# EasyEDA Pro project ACS Temperature Sensor.eprj

# Schematic Main Board

## Sheets
1 User Interface: Board Name: V3.0.0; Create Date: 2026-03-11; Page Name: User Interface; Project Name: ACS Temperature Sensor; Schematic Name: Main Board; Update Date: 2026-03-11; Company: EasyEDA.com; Page Size: A4; Version: V1.0
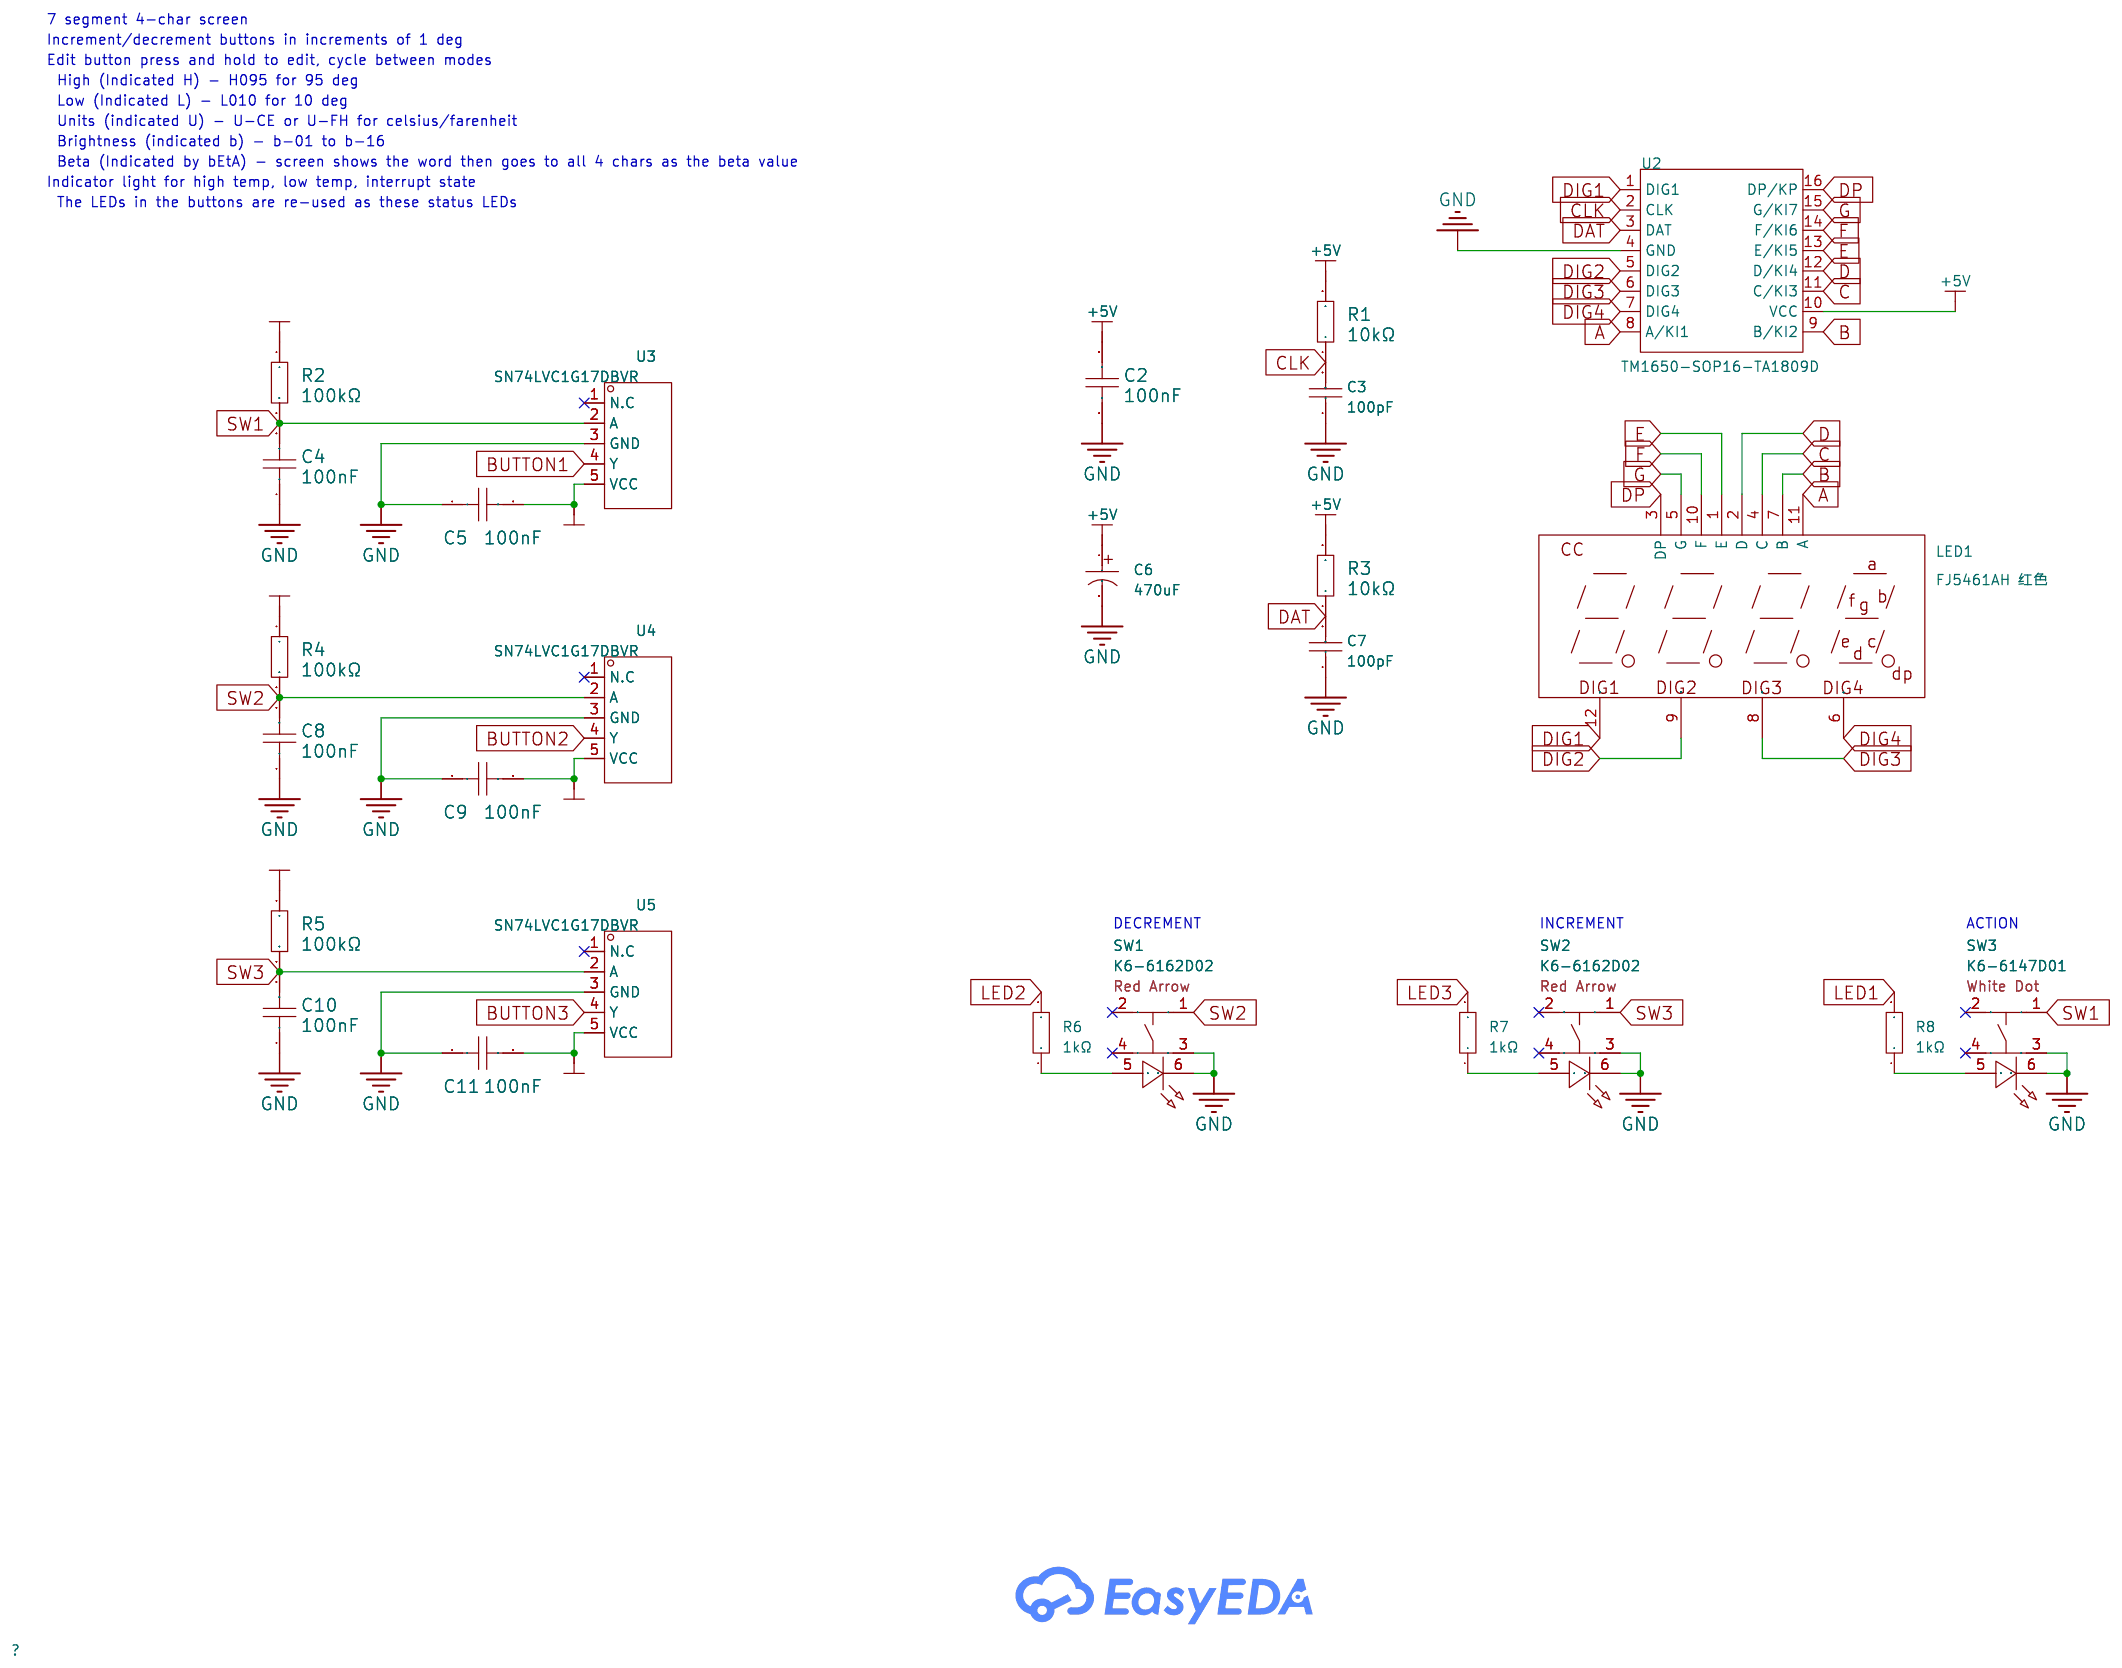
[diagram p0: User Interface]
2 ACS Interface: Page Name: ACS Interface; Update Date: 2026-03-12
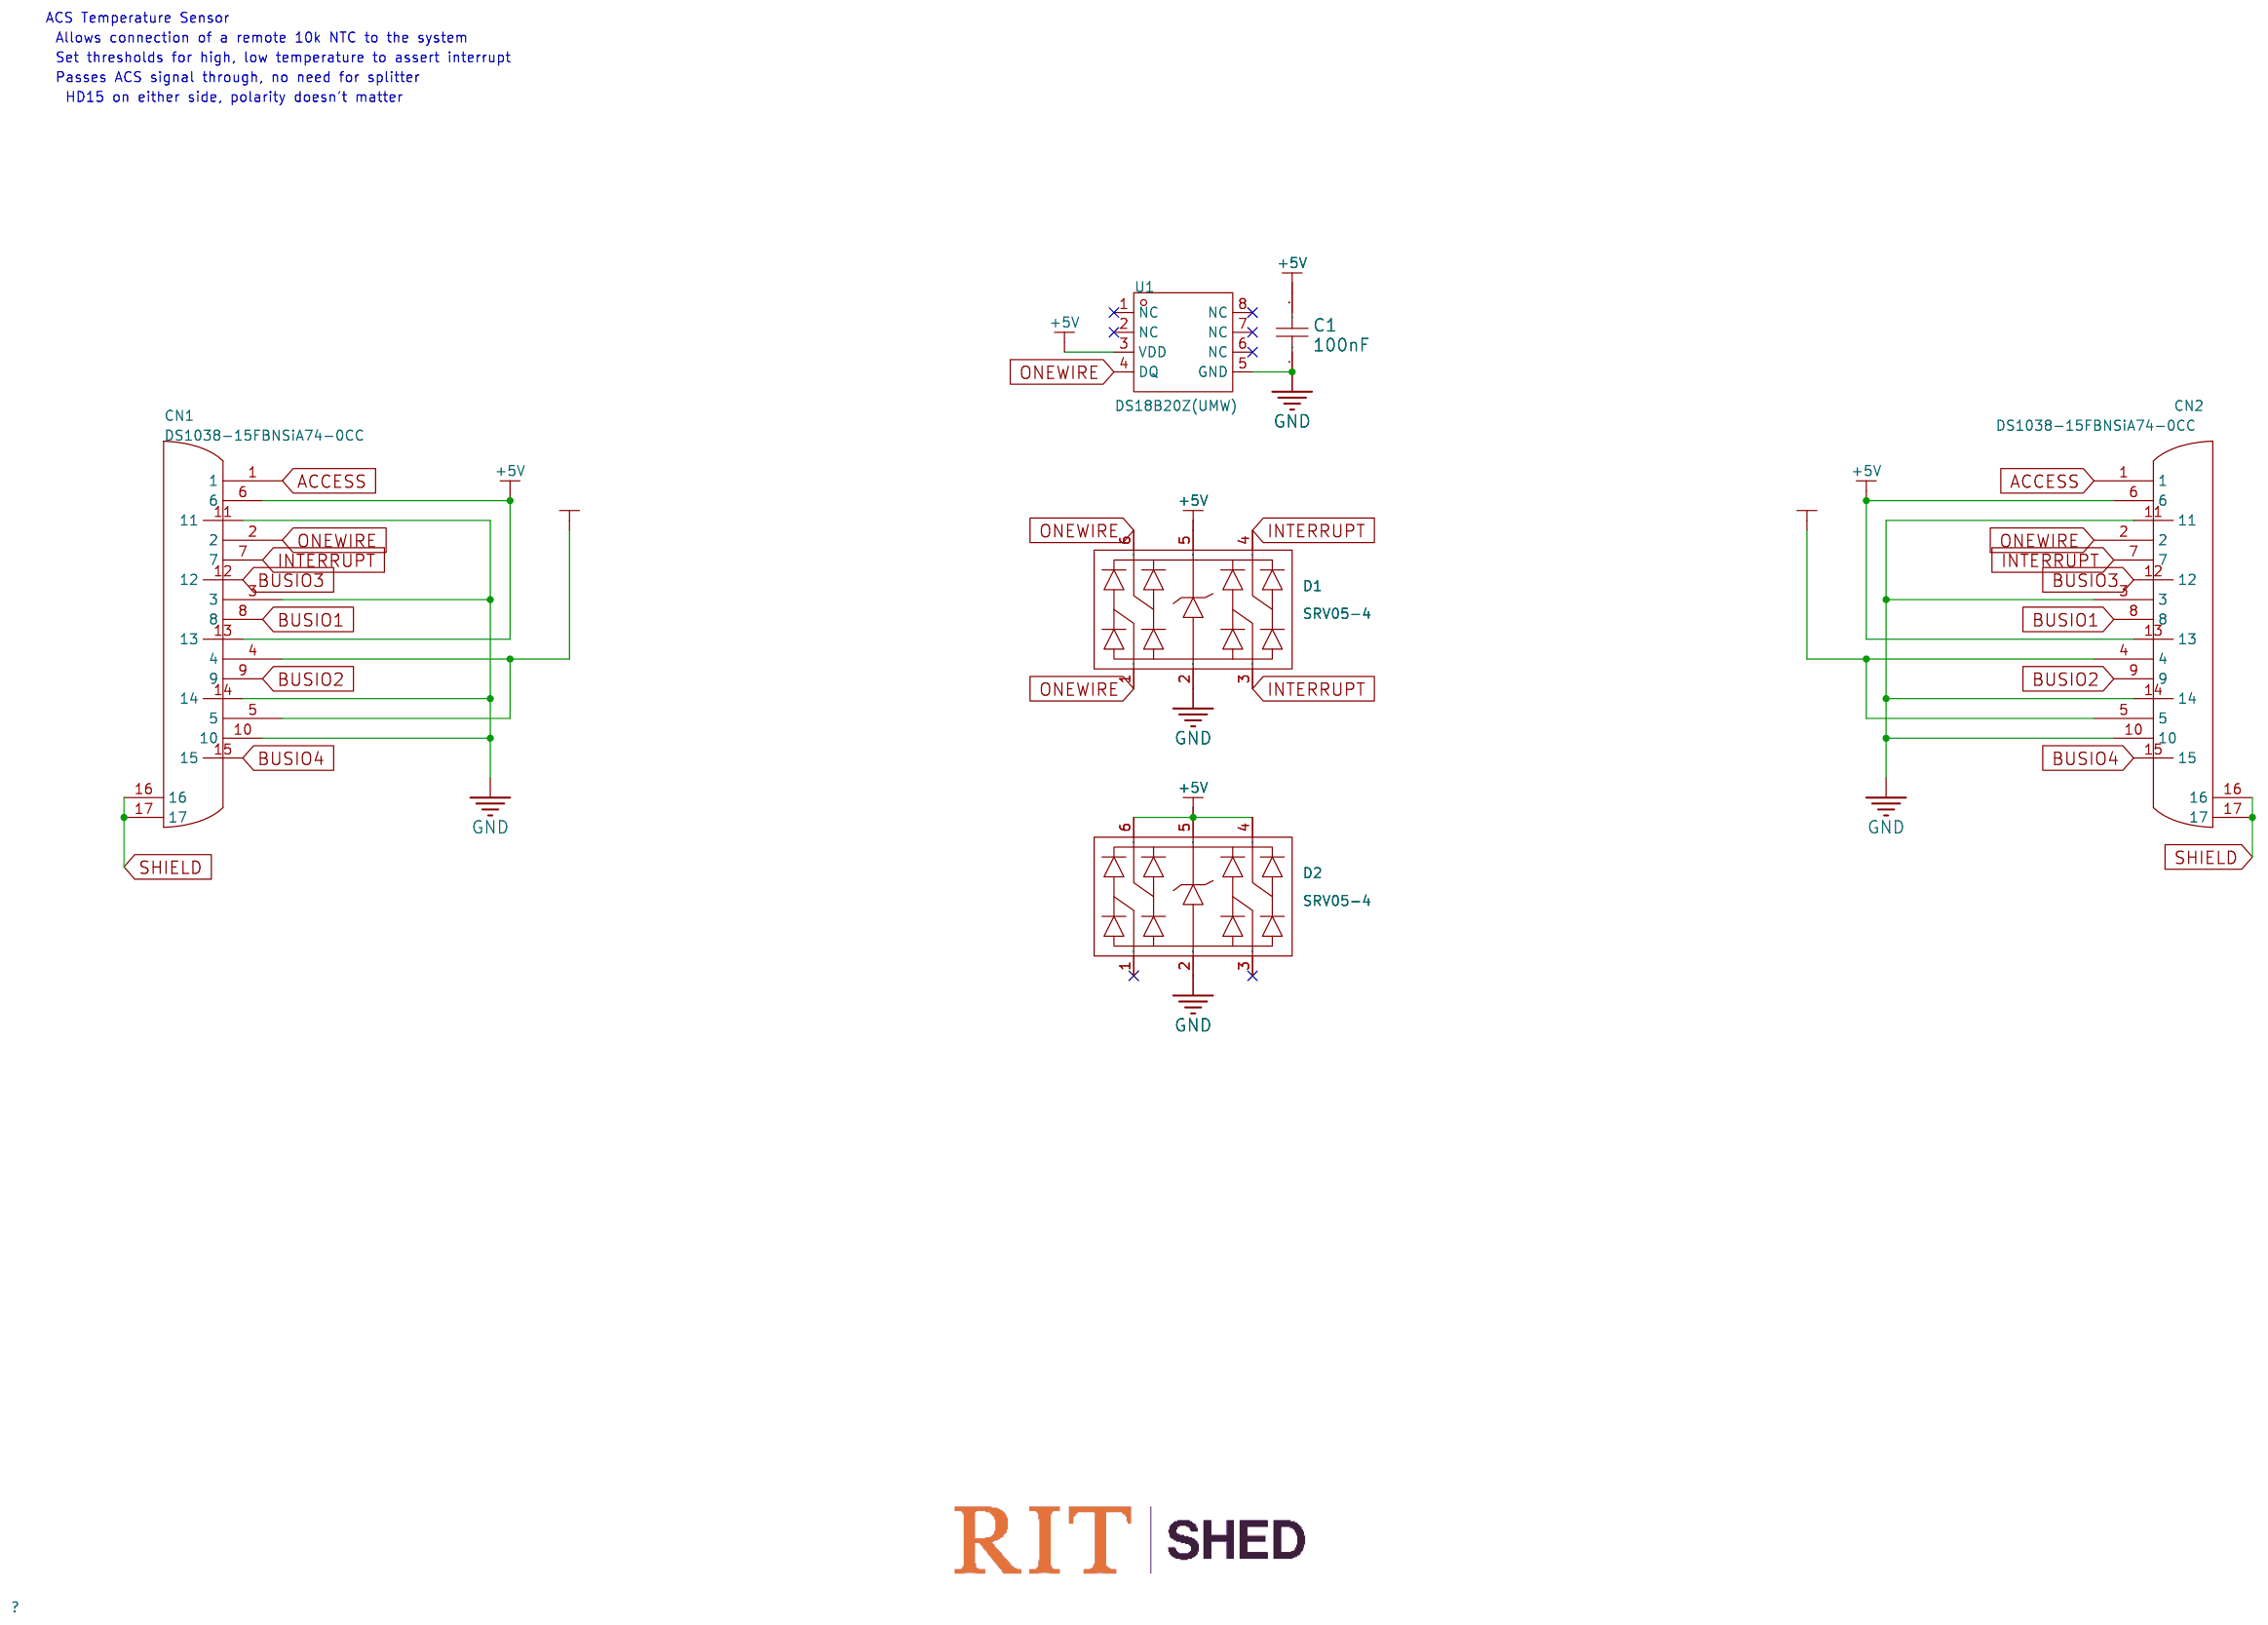
[diagram p1: ACS Interface]
3 Microcontroller: Page Name: Microcontroller
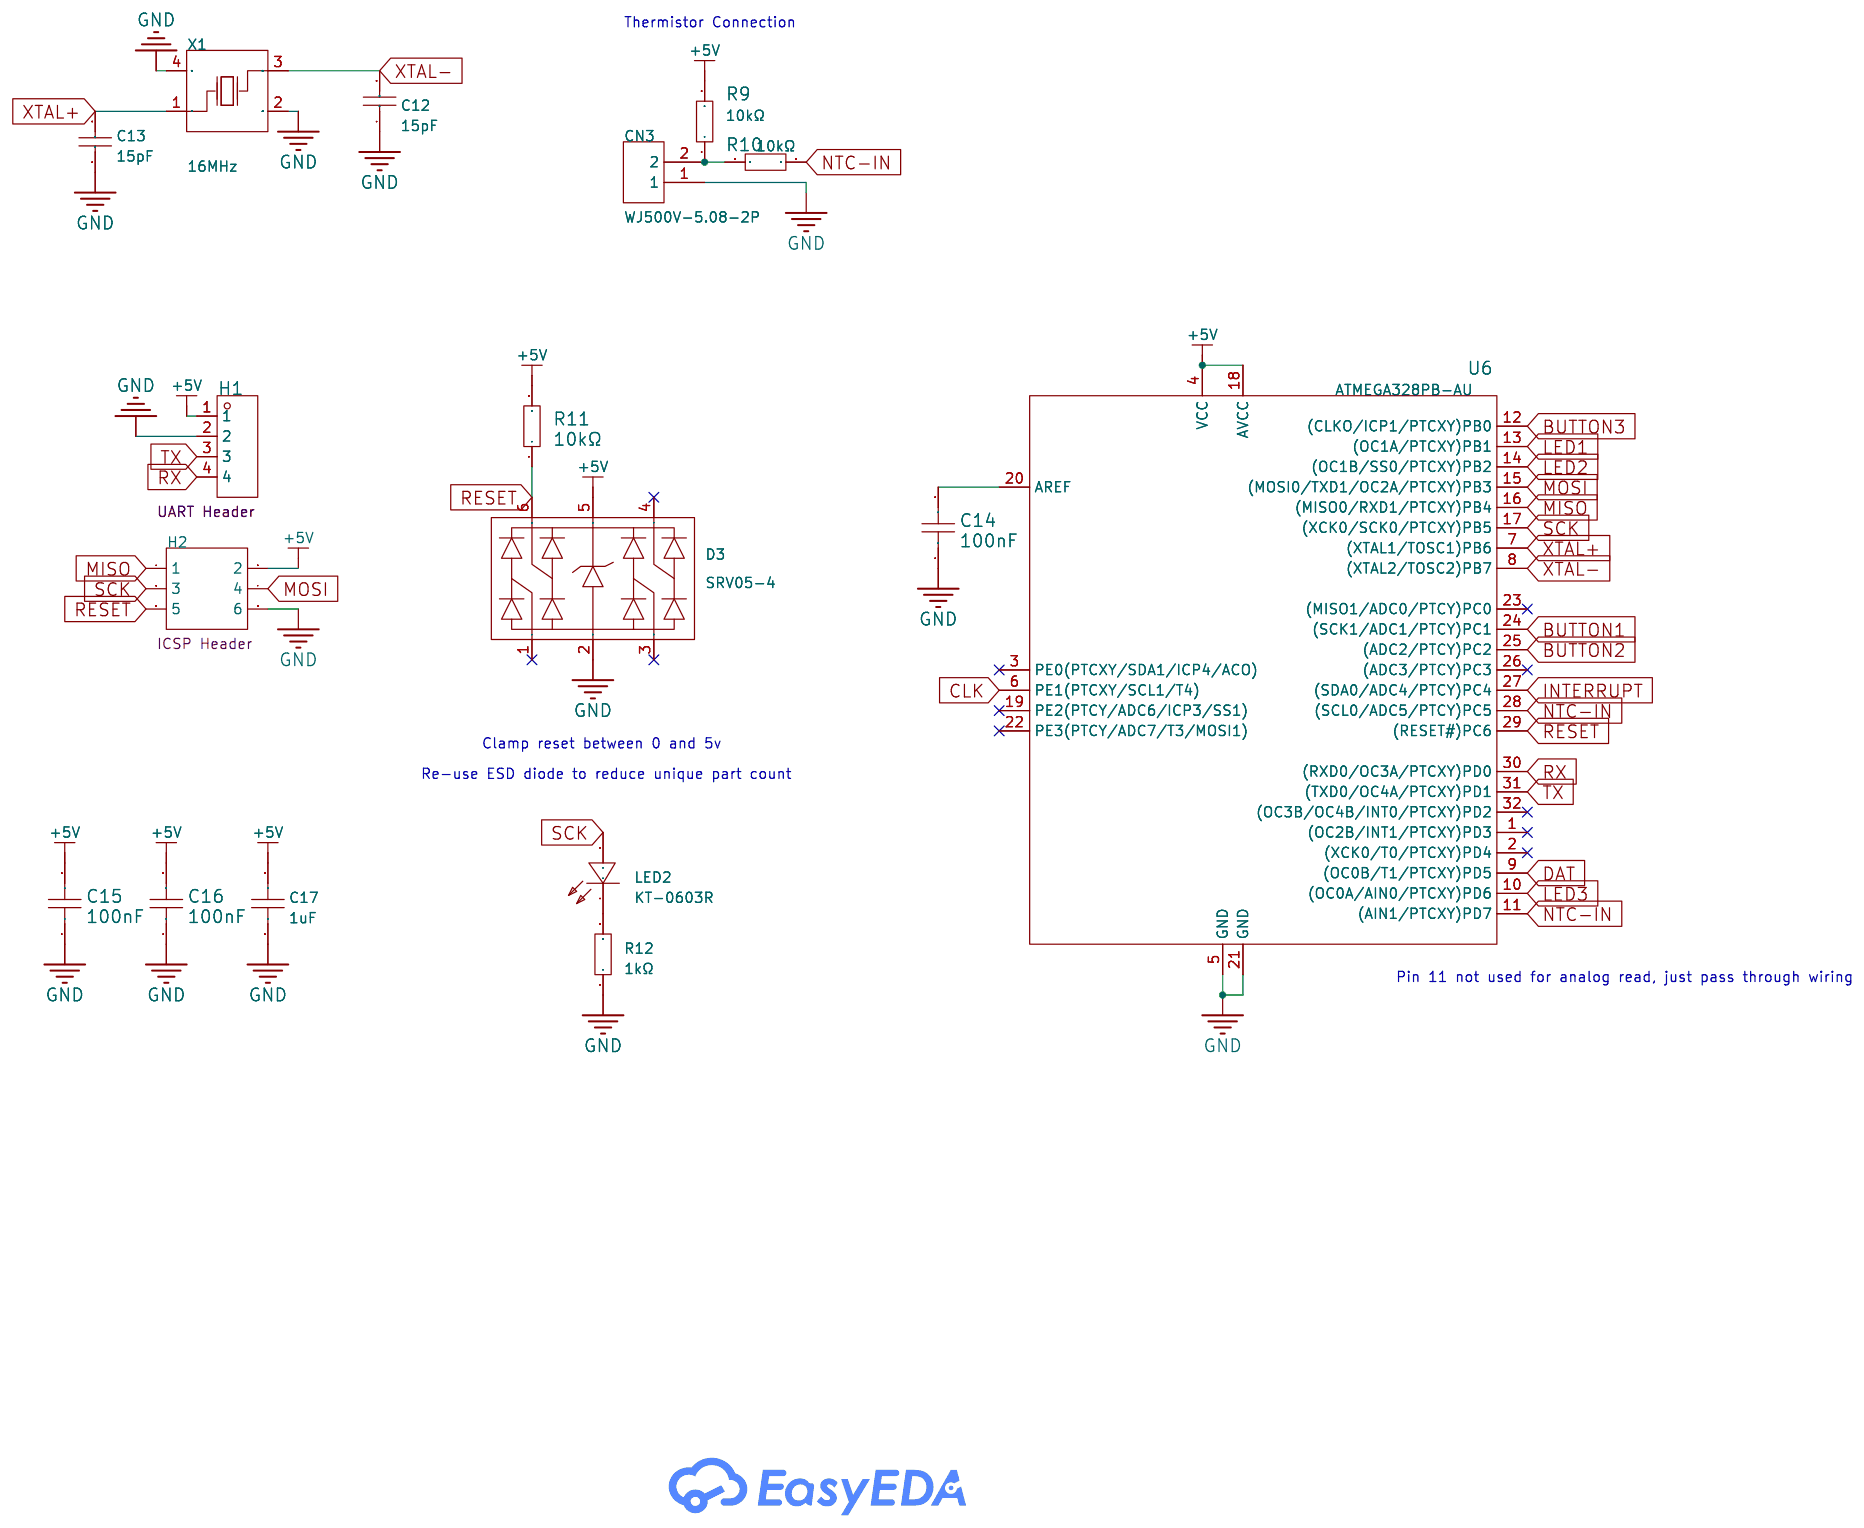
[diagram p2: Microcontroller]

## Parts
sheet ACS Interface
C1  100nF  [C0603]
CN1  DS1038-15FBNSiA74-0CC  [DSUB-TH_DS1038-15FBNSIA74-0CC]
CN2  DS1038-15FBNSiA74-0CC  [DSUB-TH_DS1038-15FBNSIA74-0CC]
D1  SRV05-4  [SOT-23-6_L2.9-W1.6-P0.95-LS2.8-BL]
D2  SRV05-4  [SOT-23-6_L2.9-W1.6-P0.95-LS2.8-BL]
U1  DS18B20Z(UMW)  [SOP-8_L4.9-W3.9-P1.27-LS6.0-BL]
sheet Microcontroller
C12  15pF  [C0603]
C13  15pF  [C0603]
C14  100nF  [C0603]
C15  100nF  [C0603]
C16  100nF  [C0603]
C17  1uF  [C0603]
CN3  WJ500V-5.08-2P  [CONN-TH_2P-P5.00_WJ500V-5.08-2P]
D3  SRV05-4  [SOT-23-6_L2.9-W1.6-P0.95-LS2.8-BL]
H1  -  [HDR-TH_4P-P2.54-V-F]
H2  -  [HDR-TH_6P-P2.54-V-F-R2-C3-S2.54]
LED2  KT-0603R  [LED0603-RD]
R9  10kΩ  [R0603]
R10  10kΩ  [R0603]
R11  10kΩ  [R0603]
R12  1kΩ  [R0603]
U6  ATMEGA328PB-AU  [TQFP-32_L7.0-W7.0-P0.80-LS9.0-BL]
X1  16MHz  [OSC-SMD_4P-L3.2-W2.5-BL]
sheet User Interface
C2  100nF  [C0603]
C3  100pF  [C0603]
C4  100nF  [C0603]
C5  100nF  [C0603]
C6  470uF  [CAP-TH_BD8.0-P3.50-D0.6-FD]
C7  100pF  [C0603]
C8  100nF  [C0603]
C9  100nF  [C0603]
C10  100nF  [C0603]
C11  100nF  [C0603]
LED1  FJ5461AH 红色  [LED-SEG-TH_FJ5461AH]
R1  10kΩ  [R0603]
R2  100kΩ  [R0603]
R3  10kΩ  [R0603]
R4  100kΩ  [R0603]
R5  100kΩ  [R0603]
R6  1kΩ  [R0603]
R7  1kΩ  [R0603]
R8  1kΩ  [R0603]
SW1  K6-6162D02  [SW-TH_K6-6162D04]
SW2  K6-6162D02  [SW-TH_K6-6162D04]
SW3  K6-6147D01  [SW-TH_K6-6162D04]
U2  TM1650-SOP16-TA1809D  [SOP-16_L9.9-W3.9-P1.27-LS6.0-BL]
U3  SN74LVC1G17DBVR  [SOT-23-5_L3.0-W1.7-P0.95-LS2.8-BR]
U4  SN74LVC1G17DBVR  [SOT-23-5_L3.0-W1.7-P0.95-LS2.8-BR]
U5  SN74LVC1G17DBVR  [SOT-23-5_L3.0-W1.7-P0.95-LS2.8-BR]

## Library data of the parts
C1 C14-C16 = CC0603KRX7R9BB104: LCSC Part Name: 100nF ±10% 50V; Supplier Part: C14663; Manufacturer: YAGEO(国巨); Supplier Footprint: 0603; Datasheet: https://item.szlcsc.com/datasheet/CC0603KRX7R9BB104/15331.html; Supplier: LCSC; Tolerance: ±10%; Voltage Rating: 50V; Temperature Coefficient: X7R
CN1 CN2 = DS1038-15FBNSiA74-0CC: Connector Type:High Density D-Sub Gender:Female Number of Pins:15P Mounting Type:Right Angle Number of Rows:3 Current Rating-Signal:3A Current Rating-Power:- Voltage Rating:- Color:Black Operating Temperature:-40℃~+105℃ Operating Temperature:-40℃~+105℃; LCSC Part Name: 黑色 1000/盒 D-Sub 母 P数:15P; Supplier Part: C75754; Manufacturer: CONNFLY; Supplier Footprint: 弯插; JLCPCB Part Class: Extended Part; Datasheet: https://item.szlcsc.com/datasheet/DS1038-15FBNSiA74-0CC/76880.html; Supplier: LCSC; Connector Type: High Density D-Sub; Gender: Female; Number of Pins: 15P; Mounting Type: Right Angle; Number of Rows: 3; Current Rating-Signal: 3A; Color: Black; Operating Temperature: -40℃~+105℃
D1-D3 = SRV05-4_C558418: polarity:Unidirectional Reverse Stand-Off Voltage (Vrwm):5V Maximum Clamping Voltage:20V Peak Pulse Current (Ipp):3A Peak Pulse Power Dissipation (Ppp):60W Breakdown Voltage:6V Reverse Leakage Current (Ir):500nA Number of Lines:Four channels Operating Tem; LCSC Part Name: ESD，可防25kV静电; Supplier Part: C558418; Manufacturer: TECH PUBLIC(台舟); Supplier Footprint: SOT-23-6; JLCPCB Part Class: Extended Part; Datasheet: https://atta.szlcsc.com/upload/public/pdf/source/20230615/CFFDFFE99FDA0E92DF9600783B3A2A20.pdf; Supplier: LCSC; polarity: Unidirectional; Reverse Stand-Off Voltage (Vrwm): 5V; Maximum Clamping Voltage: 20V; Peak Pulse Current (Ipp): 3A; Peak Pulse Power Dissipation (Ppp): 60W; Breakdown Voltage: 6V; Reverse Leakage Current (Ir): 500nA; Number of Lines: Four channels; Operating Temperature: -55℃~+125℃; level of protection: IEC 61000-4-2; Type: ESD
U1 = DS18B20Z(UMW): Temperature range:- Temperature range:- Resolution:±0.4℃ Resolution:±0.4℃ Supply Voltage:2.5V~5.5V Supply Voltage:2.5V~5.5V; LCSC Part Name: 温度传感器; Supplier Part: C695837; Manufacturer: UMW(友台半导体); Supplier Footprint: SOIC-8; JLCPCB Part Class: Extended Part; Datasheet: https://atta.szlcsc.com/upload/public/pdf/source/20241210/329D6A12FB6ADF2EBB286F6D44242ED4.pdf; Supplier: LCSC; Resolution: ±0.4℃; Supply Voltage: 2.5V~5.5V
C12 C13 = CL10C150JB8NNNC: Capacitance:15pF Tolerance:±5% Tolerance:±5% Voltage Rating:50V Temperature Coefficient:C0G; LCSC Part Name: 15pF ±5% 50V; Supplier Part: C1644; Manufacturer: SAMSUNG(三星); Supplier Footprint: 0603; JLCPCB Part Class: Basic Part; Datasheet: https://item.szlcsc.com/datasheet/CL10C150JB8NNNC/1996.html; Supplier: LCSC; Tolerance: ±5%; Voltage Rating: 50V; Temperature Coefficient: C0G
C17 = CL10A105KB8NNNC: Capacitance:1uF Tolerance:±10% Tolerance:±10% Voltage Rating:50V Temperature Coefficient:X5R; LCSC Part Name: 1uF ±10% 50V; Supplier Part: C15849; Manufacturer: SAMSUNG(三星); Supplier Footprint: 0603; JLCPCB Part Class: Basic Part; Datasheet: https://item.szlcsc.com/datasheet/CL10A105KB8NNNC/16531.html; Supplier: LCSC; Tolerance: ±10%; Voltage Rating: 50V; Temperature Coefficient: X5R
CN3 = WJ500V-5.08-2P: LCSC Part Name: 1x2P 5.08mm 直插 排数:1 每排P数:2; Supplier Part: C8465; Manufacturer: KANGNEX(康奈克斯电气); Supplier Footprint: 插件,P=5.08mm; Datasheet: https://atta.szlcsc.com/upload/public/pdf/source/20191225/C8465_02D34CE5B5B4A53DF5891601D97FA9F4.pdf; Supplier: LCSC; Structure: 1x2P; Pitch: 5.08mm; Color: Green; Mounting Style: Direct Insert; Current Rating (Max): 18A; Voltage Rating (Max): 250V; Number of Pins: 2P; Number of Rows: 1; Wire Gauge - AWG: 14~30; Wire Gauge - mm2: 2.5; Number of PINs Per Row: 2; Operating Temperature Range: -40℃~+105℃; Screw Specification: M2.5
H1 = HDR-F_2.54_1x4P: UART Header; Supplier Footprint: Through
H2 = HDR-F_2.54_2x3: ICSP Header; Supplier Footprint: Through
LED2 = KT-0603R: Emitted Color:Red Power Dissipation:- Forward Current:- Dominant Wavelength:- Dominant Wavelength:- Peak Wavelength:- Diode Configuration:- Lens Color:- Color Temperature:- Color Temperature:- Viewing Angle:- Mounting Sytle:- Operating Temperature:-40℃~+8; LCSC Part Name: 0603 红灯 高亮; Supplier Part: C2286; Manufacturer: KENTO; Supplier Footprint: 0603; Datasheet: https://atta.szlcsc.com/upload/public/pdf/source/20160616/1466072038404.pdf; Supplier: LCSC; Emitted Color: Red; Operating Temperature: -40℃~+85℃
R9 R10 = 0603WAF1002T5E: LCSC Part Name: 厚膜电阻 10kΩ ±1% 100mW; Supplier Part: C25804; Manufacturer: UNI-ROYAL(厚声); Supplier Footprint: 0603; Datasheet: https://item.szlcsc.com/datasheet/0603WAF1002T5E/26547.html; Supplier: LCSC; Type: Thick Film Resistor; Tolerance: ±1%; Power(Watts): 100mW; Voltage-Supply(Max): 75V; Temperature Coefficient: ±100ppm/℃; Operating Temperature: -55℃~+155℃
R1 R3 R11 = 0603WAF1002T5E: LCSC Part Name: 厚膜电阻 10kΩ ±1% 100mW; Supplier Part: C25804; Manufacturer: UNI-ROYAL(厚声); Supplier Footprint: 0603; JLCPCB Part Class: Basic Part; Datasheet: https://item.szlcsc.com/datasheet/0603WAF1002T5E/26547.html; Supplier: LCSC; Type: Thick Film Resistor; Tolerance: ±1%; Power(Watts): 100mW; Voltage-Supply(Max): 75V; Temperature Coefficient: ±100ppm/℃; Operating Temperature: -55℃~+155℃; Operating Temperature Range: -55℃~+155℃
R6-R8 R12 = 0603WAF1001T5E: Type:Thick Film Resistor Resistance:1kΩ Tolerance:±1% Tolerance:±1% Power(Watts):100mW Voltage-Supply(Max):75V Temperature Coefficient:±100ppm/℃ Temperature Coefficient:±100ppm/℃ Operating Temperature:-55℃~+155℃ Operating Temperature:-55℃~+155℃; LCSC Part Name: 1kΩ ±1% 100mW 厚膜电阻; Supplier Part: C21190; Manufacturer: UNI-ROYAL(厚声); Supplier Footprint: 0603; JLCPCB Part Class: Basic Part; Datasheet: https://item.szlcsc.com/datasheet/0603WAF1001T5E/21904.html; Supplier: LCSC; Type: Thick Film Resistor; Tolerance: ±1%; Power(Watts): 100mW; Voltage-Supply(Max): 75V; Temperature Coefficient: ±100ppm/℃; Operating Temperature: -55℃~+155℃
U6 = ATMEGA328PB-AU: CPU Core:AVR CPU Maximum Speed:20MHz Core Size:8 Bit Program Storage Size:32KB Program Memory Type:FLASH RAM Size:2KB EEPROM:1KB Number of I/O:27 ADC (Bit):10bit Oscillator Type:Built-in Voltage - Supply:1.8V~5.5V Voltage - Supply:1.8V~5.5V Operating Temp; Supplier Part: C132230; Manufacturer: MICROCHIP(美国微芯); Supplier Footprint: TQFP-32(7x7); Datasheet: https://item.szlcsc.com/datasheet/ATMEGA328PB-AU/143529.html; Supplier: LCSC; CPU Core: AVR; CPU Maximum Speed: 20MHz; Core Size: 8 Bit; Program Storage Size: 32KB; Program Memory Type: FLASH; RAM Size: 2KB; EEPROM: 1KB; Number of I/O: 27; ADC (Bit): 10bit; Oscillator Type: Built-in; Voltage - Supply: 1.8V~5.5V; Operating Temperature: -40℃~+85℃
X1 = X322516MLB4SI: Type:Crystal Oscillator Frequency:16MHz Normal temperature Frequency Tolerance:±10ppm Normal temperature Frequency Tolerance:±10ppm Load Capacitance:9pF Frequency Stability:±20ppm Frequency Stability:±20ppm Operating Temperature:-40℃~+85℃ Operating Temper; LCSC Part Name: YSX321SL 16MHZ 4P 3225 9PF ±10PPM -40~85℃ (±20PPM); Supplier Part: C13738; Manufacturer: YXC(扬兴晶振); Supplier Footprint: SMD3225-4P; JLCPCB Part Class: Basic Part; Datasheet: https://item.szlcsc.com/datasheet/X322516MLB4SI/14393.html; Supplier: LCSC; Type: Crystal Oscillator; Normal temperature Frequency Tolerance: ±10ppm; Load Capacitance: 9pF; Frequency Stability: ±20ppm; Operating Temperature: -40℃~+85℃
C2 C4 C5 C8-C11 = CC0603KRX7R9BB104: LCSC Part Name: 100nF ±10% 50V; Supplier Part: C14663; Manufacturer: YAGEO(国巨); Supplier Footprint: 0603; JLCPCB Part Class: Basic Part; Datasheet: https://item.szlcsc.com/datasheet/CC0603KRX7R9BB104/15331.html; Supplier: LCSC; Tolerance: ±10%; Voltage Rating: 50V; Temperature Coefficient: X7R
C3 C7 = CL10C101JB8NNNC: LCSC Part Name: 100pF ±5% 50V; Supplier Part: C14858; Manufacturer: SAMSUNG(三星); Supplier Footprint: 0603; Datasheet: https://item.szlcsc.com/datasheet/CL10C101JB8NNNC/15530.html; Supplier: LCSC; Tolerance: ±5%; Voltage Rating: 50V; Temperature Coefficient: C0G
C6 = ZF477M016F07RR0VH4FPV: LCSC Part Name: 黑 470uF ±20% 16V; Supplier Part: C44604; Manufacturer: Chengx(承兴); Supplier Footprint: 插件,D8xL7mm; Datasheet: https://item.szlcsc.com/datasheet/ZF477M016F07RR0VH4FPV/45606.html; Supplier: LCSC; Tolerance: ±20%; Voltage Rating: 16V; Pin Spacing: 3.5mm; Diameter: 8mm; Height - Seated (Max): 7mm; Lifetime: 1000hrs@105℃; Operating Temperature: -40℃~+105℃
LED1 = FJ5461AH 红色: LCSC Part Name: 4位0.56英寸红色数码管 共阴极; Supplier Part: C54396; Manufacturer: 志浩; Supplier Footprint: 插件; Datasheet: https://item.szlcsc.com/datasheet/FJ5461AH%2520%25E7%25BA%25A2%25E8%2589%25B2/55414.html; Supplier: LCSC; Number of Characters: 4; Display Type: 7 Segment; Digit/Alpha Size(inch): 0.56; Illumination Color: Red; LED Polarity: Common Cathode
R2 R4 R5 = 0603WAF1003T5E: Type:Thick Film Resistor Resistance:100kΩ Tolerance:±1% Tolerance:±1% Power(Watts):100mW Voltage-Supply(Max):75V Temperature Coefficient:±100ppm/℃ Temperature Coefficient:±100ppm/℃ Operating Temperature:-55℃~+155℃ Operating Temperature:-55℃~+155℃; LCSC Part Name: 100kΩ ±1% 100mW 厚膜电阻; Supplier Part: C25803; Manufacturer: UNI-ROYAL(厚声); Supplier Footprint: 0603; JLCPCB Part Class: Basic Part; Datasheet: https://item.szlcsc.com/datasheet/0603WAF1003T5E/26546.html; Supplier: LCSC; Type: Thick Film Resistor; Tolerance: ±1%; Power(Watts): 100mW; Voltage-Supply(Max): 75V; Temperature Coefficient: ±100ppm/℃; Operating Temperature: -55℃~+155℃; Operating Temperature Range: -55℃~+155℃
SW1 SW2 = K6-6162D02: LCSC Part Name: 红色带灯开关箭头帽; Supplier Part: C693807; Manufacturer: 韩国韩荣; Supplier Footprint: 插件; Datasheet: https://atta.szlcsc.com/upload/public/pdf/source/20200629/C693808_D4F420960E2BB3B4B85B348833973C9C.pdf; Supplier: LCSC; Operating Force: 160gf; Mounting Style: Straight; Switch Height: 10mm; Contact Current: 50mA; Voltage Rating (DC): 12V; With Lamp: Red; Mechanical Life: 10万次; Operating Temperature: -25℃~+85℃; Note: Red Arrow
SW3 = K6-6147D01: LCSC Part Name: 白色带灯开关; Supplier Part: C693789; Manufacturer: 韩国韩荣; Supplier Footprint: 插件; JLCPCB Part Class: Extended Part; Datasheet: https://item.szlcsc.com/datasheet/K6-6147D01/726329.html; Supplier: LCSC; Operating Force: 1.6N; Mounting Type: Through Hole; Switch Height: 10mm; Contact Current: 50mA; Voltage Rating: 12V; With Lamp: White; Life: 100,000 Cycles; Operating Temperature: -25℃~+85℃; Note: White Dot
U2 = TM1650-SOP16-TA1809D: Supplier Part: C52200315; Manufacturer: TM(天微); Supplier Footprint: SOP-16; JLCPCB Part Class: Extended Part; Datasheet: https://item.szlcsc.com/datasheet/TM1650-SOP16-TA1809D/55034946.html; Supplier: LCSC; Voltage - Input(DC): 3V~5.5V; Dimming: Digital; Operating temperature: -40℃~+85℃
U3-U5 = SN74LVC1G17DBVR: Input type:Schmitt Trigger output type:推挽 Supply Voltage:1.65V~5.5V Supply Voltage:1.65V~5.5V Number of Elements:1 Number of Bits per Element:1 Sink Current:32mA Source Current:32mA Logic Family:74LVC Operating Temperature:-40℃~+125℃ Operating Temperature; Supplier Part: C7836; Manufacturer: TI(德州仪器); Supplier Footprint: SOT-23-5; JLCPCB Part Class: Extended Part; Datasheet: https://www.ti.com/cn/lit/gpn/sn74lvc1g17; Supplier: LCSC; Input type: Schmitt Trigger; output type: 推挽; Supply Voltage: 1.65V~5.5V; Number of Elements: 1; Number of Bits per Element: 1; Sink Current: 32mA; Source Current: 32mA; Logic Family: 74LVC; Operating Temperature: -40℃~+125℃; NO_CONNECT: yes

## Nets
+5V: C1.2 C2.2 C5.2 C6.1 C9.2 C11.2 C15.2 C16.2 C17.2 CN1.6 CN1.13 CN2.6 CN2.13 D1.5 D2.4 D2.5 D2.6 D3.5 H1.1 H2.2 R1.2 R2.1 R3.2 R4.1 R5.1 R9.2 R11.2 U1.3(VDD) U2.10(VCC) U3.5(VCC) U4.5(VCC) U5.5(VCC) U6.4(VCC) U6.18(AVCC)
+12V-BUS: CN1.4 CN1.5 CN2.4 CN2.5
GND: C1.1 C2.1 C3.1 C4.1 C5.1 C6.2 C7.1 C8.1 C9.1 C10.1 C11.1 C12.1 C13.1 C14.1 C15.1 C16.1 C17.1 CN1.3 CN1.10 CN1.11 CN1.14 CN2.3 CN2.10 CN2.11 CN2.14 CN3.1 D1.2 D2.2 D3.2 H1.2 H2.6 R12.1 SW1.3 SW1.6 SW2.3 SW2.6 SW3.3 SW3.6 U1.5(GND) U2.4(GND) U3.3(GND) U4.3(GND) U5.3(GND) U6.5(GND) U6.21(GND) X1.2(GND) X1.4(GND)
A: LED1.11(A) U2.8(A/KI1)
ACCESS: CN1.1 CN2.1
B: LED1.7(B) U2.9(B/KI2)
BUSIO1: CN1.8 CN2.8
BUSIO2: CN1.9 CN2.9
BUSIO3: CN1.12 CN2.12
BUSIO4: CN1.15 CN2.15
BUTTON1: U3.4(Y) U6.24((SCK1/ADC1/PTCY)PC1)
BUTTON2: U4.4(Y) U6.25((ADC2/PTCY)PC2)
BUTTON3: U5.4(Y) U6.12((CLKO/ICP1/PTCXY)PB0)
C: LED1.4(C) U2.11(C/KI3)
CLK: C3.2 R1.1 U2.2(CLK) U6.6(PE1(PTCXY/SCL1/T4))
D: LED1.2(D) U2.12(D/KI4)
DAT: C7.2 R3.1 U2.3(DAT) U6.9((OC0B/T1/PTCXY)PD5)
DIG1: LED1.12(DIG1) U2.1(DIG1)
DIG2: LED1.9(DIG2) U2.5(DIG2)
DIG3: LED1.8(DIG3) U2.6(DIG3)
DIG4: LED1.6(DIG4) U2.7(DIG4)
DP: LED1.3(DP) U2.16(DP/KP)
E: LED1.1(E) U2.13(E/KI5)
F: LED1.10(F) U2.14(F/KI6)
G: LED1.5(G) U2.15(G/KI7)
INTERRUPT: CN1.7 CN2.7 D1.3 D1.4 U6.27((SDA0/ADC4/PTCY)PC4)
LED1: R8.2 U6.13((OC1A/PTCXY)PB1)
LED2: R6.2 U6.14((OC1B/SS0/PTCXY)PB2)
LED3: R7.2 U6.10((OC0A/AIN0/PTCXY)PD6)
MISO: H2.1 U6.16((MISO0/RXD1/PTCXY)PB4)
MOSI: H2.4 U6.15((MOSI0/TXD1/OC2A/PTCXY)PB3)
NTC-IN: R10.1 U6.11((AIN1/PTCXY)PD7) U6.28((SCL0/ADC5/PTCY)PC5)
ONEWIRE: CN1.2 CN2.2 D1.1 D1.6 U1.4(DQ)
RESET: D3.6 H2.5 R11.1 U6.29((RESET#)PC6)
RX: H1.4 U6.30((RXD0/OC3A/PTCXY)PD0)
SCK: H2.3 LED2.2(A) U6.17((XCK0/SCK0/PTCXY)PB5)
SHIELD: CN1.16 CN1.17 CN2.16 CN2.17
SW1: C4.2 R2.2 SW3.1 U3.2(A)
SW2: C8.2 R4.2 SW1.1 U4.2(A)
SW3: C10.2 R5.2 SW2.1 U5.2(A)
TX: H1.3 U6.31((TXD0/OC4A/PTCXY)PD1)
XTAL+: C13.2 U6.7((XTAL1/TOSC1)PB6) X1.1(OSC1)
XTAL-: C12.2 U6.8((XTAL2/TOSC2)PB7) X1.3(OSC2)
$2N1913: R6.1 SW1.5
$2N1920: R7.1 SW2.5
$2N1927: R8.1 SW3.5
$4N459: CN3.2 R9.1 R10.2
$4N1957: LED2.1(K) R12.2
$4N3056: C14.2 U6.20(AREF)

Not connected (* = marked no-connect by the designer): D2 1* 3*; D3 1* 3* 4*; SW1 2* 4*; SW2 2* 4*; SW3 2* 4*; U1 1(NC)* 2(NC)* 6(NC)* 7(NC)* 8(NC)*; U3 1(N.C)*; U4 1(N.C)*; U5 1(N.C)*; U6 1((OC2B/INT1/PTCXY)PD3)* 2((XCK0/T0/PTCXY)PD4)* 3(PE0(PTCXY/SDA1/ICP4/ACO))* 19(PE2(PTCY/ADC6/ICP3/SS1))* 22(PE3(PTCY/ADC7/T3/MOSI1))* 23((MISO1/ADC0/PTCY)PC0)* 26((ADC3/PTCY)PC3)* 32((OC3B/OC4B/INT0/PTCXY)PD2)*

## Notes on the sheets
sheet 1
- 7 segment 4-char screen
- Increment/decrement buttons in increments of 1 deg
- Edit button press and hold to edit, cycle between modes
- High (Indicated H) - H095 for 95 deg
- Low (Indicated L) - L010 for 10 deg
- Units (indicated U) - U-CE or U-FH for celsius/farenheit
- Beta (Indicated by bEtA) - screen shows the word then goes to all 4 chars as the beta value
- Brightness (indicated b) - b-01 to b-16
- Indicator light for high temp, low temp, interrupt state
- The LEDs in the buttons are re-used as these status LEDs
- DECREMENT
- INCREMENT
- ACTION
sheet 2
- ACS Temperature Sensor
- Allows connection of a remote 10k NTC to the system
- Set thresholds for high, low temperature to assert interrupt
- Passes ACS signal through, no need for splitter
- HD15 on either side, polarity doesn't matter
sheet 3
- Thermistor Connection
- Clamp reset between 0 and 5v
- Re-use ESD diode to reduce unique part count
- Pin 11 not used for analog read, just pass through wiring

# Board V3.0.0 PCB
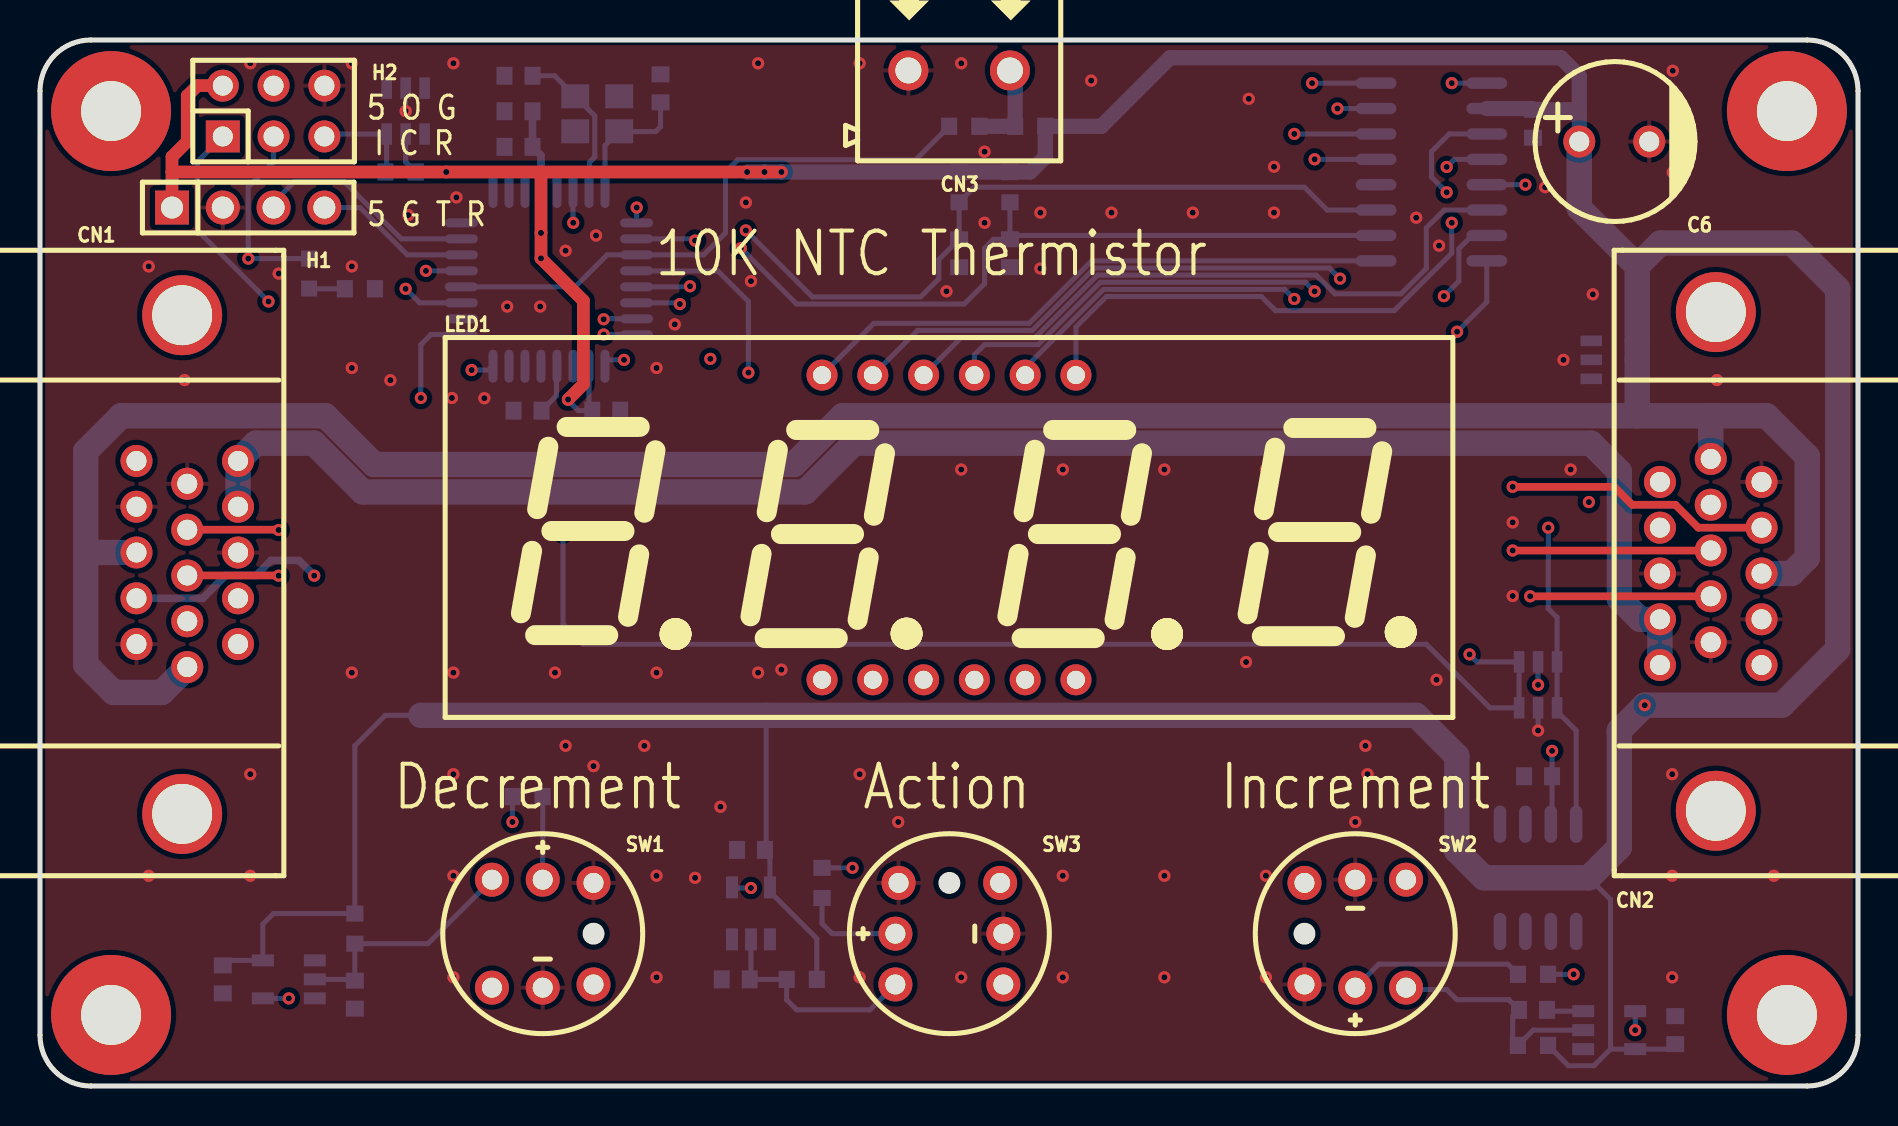
[diagram p3: board, top side]
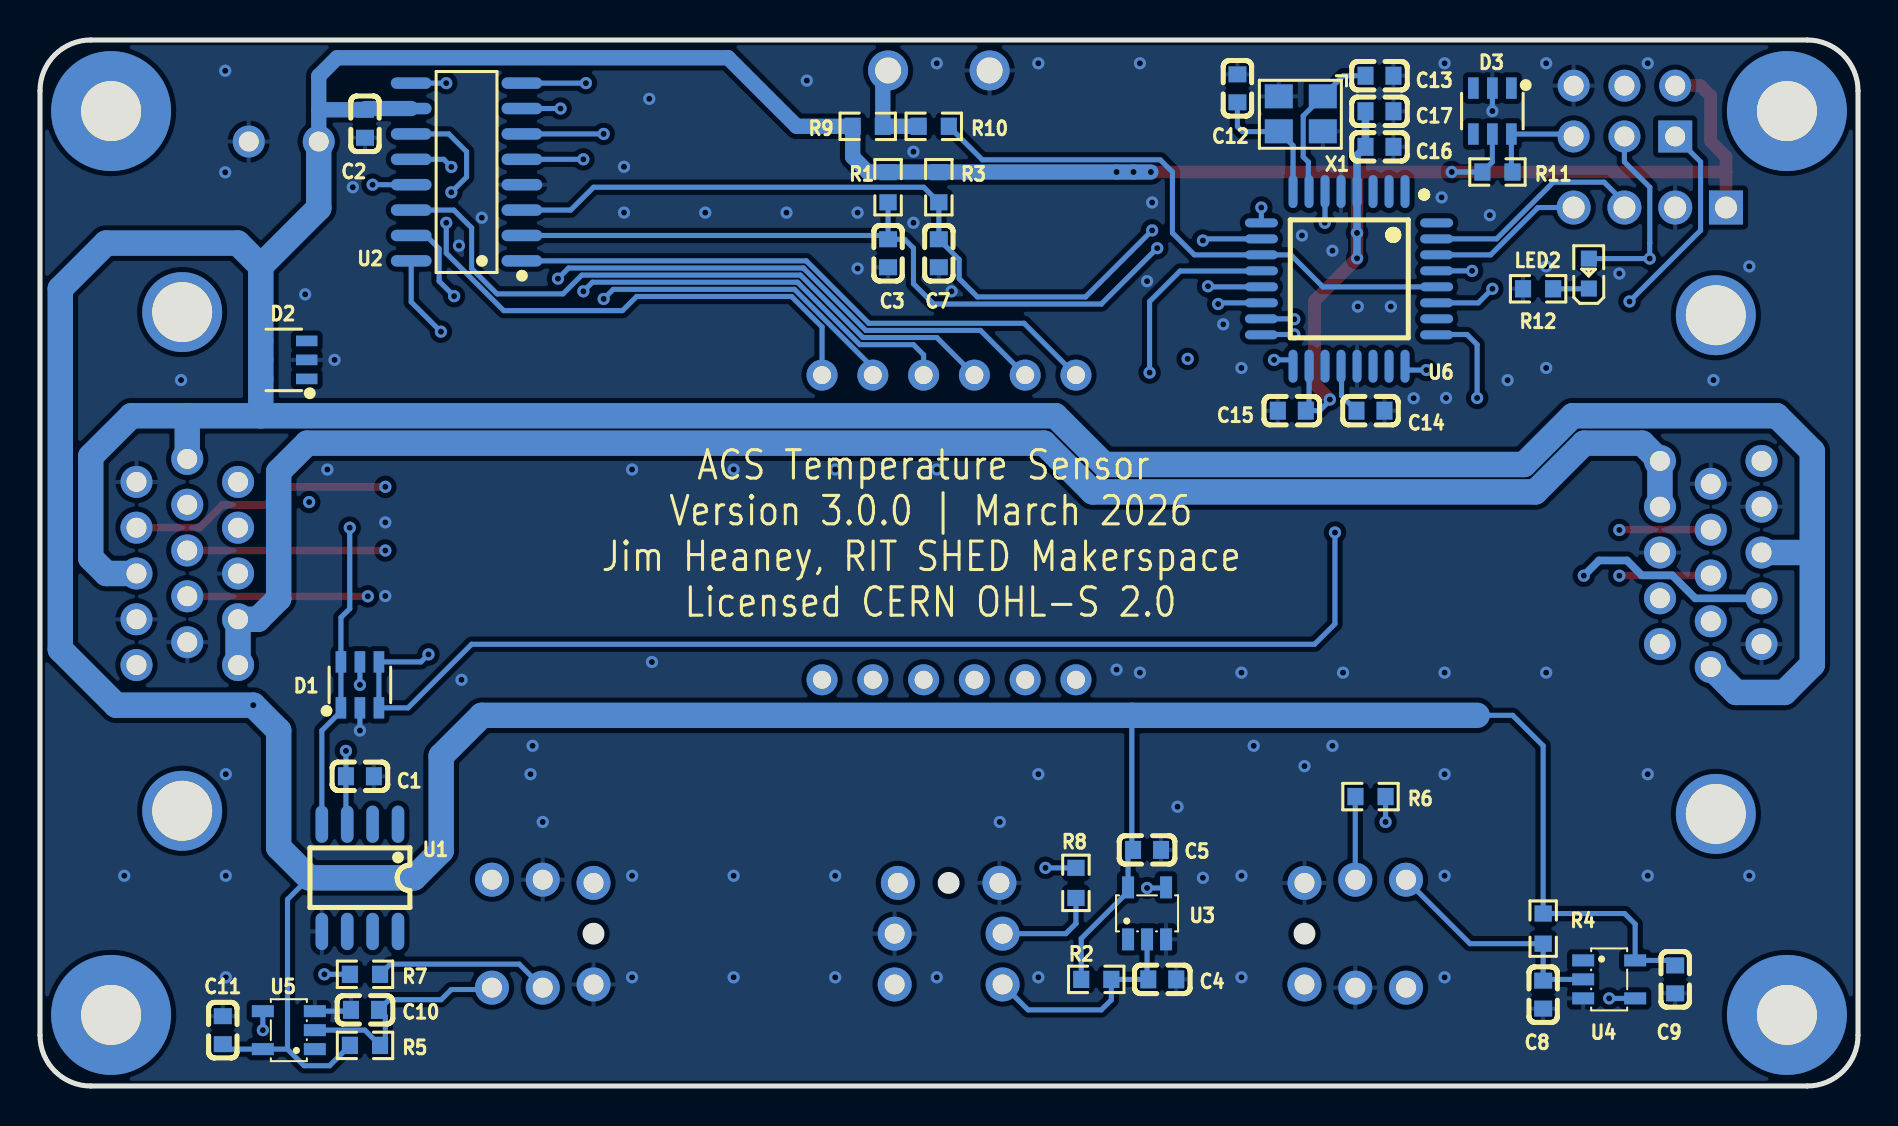
[diagram p4: board, bottom side, seen from below]

Outline 90.93 x 52.32 mm; copper layers: Top Layer, Inner1, Inner2, Bottom Layer. Coordinates in mm from the lower left corner of the outline.
Outline path: 0,49.78 0,2.54 arc(0.74,0.74) 2.54,0 88.39,0 arc(90.19,0.74) 90.93,2.54 90.93,49.78 arc(90.19,51.58) 88.39,52.32 2.54,52.32 arc(0.74,51.58) 0,49.78
Stack: Top Layer 0.035mm Outer layer thickness 1oz / Dielectric1 0.2104mm 7628 RC49% 8.6mil / Inner1 0.0152mm Inner layer thickness / Dielectric2 1.065mm 1.1mm H/HOZ Copper / Inner2 0.0152mm Inner layer thickness / Dielectric3 0.2104mm 7628 RC49% 8.6mil / Bottom Layer 0.035mm Outer layer thickness 1oz

## Design rules (mm)
template: JLCPCB Capability(Two Layers Board)
spacing copperThickness1oz (default): track to track 0.102, other pairs 0.152 to 0.3
spacing copperThickness2oz: track to track 0.203, other pairs 0.152 to 0.3
track width copperThickness1oz (default): min 0.127, default 0.254, max 2.54
track width copperThickness2oz: min 0.203, default 0.254, max 2.54
differential pair differentialPair (default): width min 0.127, default 0.254, max 2.54; gap min 0.152, default 0.152
via viaSize (default): diameter min 0.5, default 0.61, max 10; hole min 0.3, default 0.305, max 6.3

## Placement (name value [footprint] x y rotation side)
C1  100nF  [C0603]  74.93 15.49 0 bottom
C2  100nF  [C0603]  74.68 48.13 90 bottom
C3  100pF  [C0603]  48.51 41.66 90 bottom
C4  100nF  [C0603]  34.8 5.33 0 bottom
C5  100nF  [C0603]  35.56 11.81 0 bottom
C6  470uF  [CAP-TH_BD8.0-P3.50-D0.6-FD]  78.74 47.24 0 top
C7  100pF  [C0603]  45.97 41.66 90 bottom
C8  100nF  [C0603]  15.75 4.57 90 bottom
C9  100nF  [C0603]  9.14 5.33 90 bottom
C10  100nF  [C0603]  74.68 3.81 180 bottom
C11  100nF  [C0603]  81.79 2.79 270 bottom
C12  15pF  [C0603]  31.04 49.91 270 bottom
C13  15pF  [C0603]  23.93 50.54 0 bottom
C14  100nF  [C0603]  24.38 33.78 0 bottom
C15  100nF  [C0603]  28.32 33.78 180 bottom
C16  100nF  [C0603]  23.93 46.98 0 bottom
C17  1uF  [C0603]  23.93 48.76 0 bottom
CN1  DS1038-15FBNSiA74-0CC  [DSUB-TH_DS1038-15FBNSIA74-0CC]  7.37 26.08 270 top
CN2  DS1038-15FBNSiA74-0CC  [DSUB-TH_DS1038-15FBNSIA74-0CC]  83.57 26.24 90 top
CN3  WJ500V-5.08-2P  [CONN-TH_2P-P5.00_WJ500V-5.08-2P]  45.97 50.8 0 top
D1  SRV05-4  [SOT-23-6_L2.9-W1.6-P0.95-LS2.8-BL]  74.93 20.07 180 bottom
D2  SRV05-4  [SOT-23-6_L2.9-W1.6-P0.95-LS2.8-BL]  78.74 36.32 90 bottom
D3  SRV05-4  [SOT-23-6_L2.9-W1.6-P0.95-LS2.8-BL]  18.29 48.77 0 bottom
H1  -  [HDR-TH_4P-P2.54-V-F]  10.41 43.94 0 top
H2  -  [HDR-TH_6P-P2.54-V-F-R2-C3-S2.54]  11.68 48.77 0 top
LED1  FJ5461AH 红色  [LED-SEG-TH_FJ5461AH]  45.47 27.94 0 top
LED2  KT-0603R  [LED0603-RD]  13.46 40.64 90 bottom
NOREF  -  [Pad_e58]  87.38 48.77 0 top
NOREF#2  -  [Pad_e56]  3.56 3.56 0 top
NOREF#3  -  [Pad_e57]  87.38 3.56 0 top
NOREF#4  -  [Pad_e54]  3.56 48.77 0 top
R1  10kΩ  [R0603]  48.51 44.96 90 bottom
R2  100kΩ  [R0603]  38.1 5.33 180 bottom
R3  10kΩ  [R0603]  45.97 44.96 90 bottom
R4  100kΩ  [R0603]  15.75 7.87 270 bottom
R5  100kΩ  [R0603]  74.68 2.03 180 bottom
R6  1kΩ  [R0603]  24.38 14.48 180 bottom
R7  1kΩ  [R0603]  74.68 5.59 0 bottom
R8  1kΩ  [R0603]  39.12 10.16 90 bottom
R9  10kΩ  [R0603]  49.53 48.01 0 bottom
R10  10kΩ  [R0603]  46.23 48.01 0 bottom
R11  10kΩ  [R0603]  18.03 45.72 0 bottom
R12  1kΩ  [R0603]  16 39.88 180 bottom
SW1  K6-6162D02  [SW-TH_K6-6162D04]  25.15 7.62 180 top
SW2  K6-6162D02  [SW-TH_K6-6162D04]  65.79 7.62 0 top
SW3  K6-6147D01  [SW-TH_K6-6162D04]  45.48 7.62 270 top
U1  DS18B20Z(UMW)  [SOP-8_L4.9-W3.9-P1.27-LS6.0-BL]  74.93 10.41 0 bottom
U2  TM1650-SOP16-TA1809D  [SOP-16_L9.9-W3.9-P1.27-LS6.0-BL]  69.6 45.72 90 bottom
U3  SN74LVC1G17DBVR  [SOT-23-5_L3.0-W1.7-P0.95-LS2.8-BR]  35.56 8.64 270 bottom
U4  SN74LVC1G17DBVR  [SOT-23-5_L3.0-W1.7-P0.95-LS2.8-BR]  12.45 5.33 0 bottom
U5  SN74LVC1G17DBVR  [SOT-23-5_L3.0-W1.7-P0.95-LS2.8-BR]  78.49 2.79 180 bottom
U6  ATMEGA328PB-AU  [TQFP-32_L7.0-W7.0-P0.80-LS9.0-BL]  25.46 40.38 0 bottom
X1  16MHz  [OSC-SMD_4P-L3.2-W2.5-BL]  27.87 48.63 0 bottom

## Footprints (pads in the part's own frame, mm; a bottom-side part is the same pattern mirrored in y, then rotated)
C0603
  rect 0.8x0.9 smd: 1(-0.7,0) 2(0.7,0)
CAP-TH_BD8.0-P3.50-D0.6-FD
  round 1.6 hole 1: 1(-1.75,0) 2(1.75,0)
CONN-TH_2P-P5.00_WJ500V-5.08-2P
  round 2 hole 1.3: 1(-2.54,0) 2(2.54,0)
DSUB-TH_DS1038-15FBNSIA74-0CC
  round 1.6 hole 1: 1(3.978,2.54) 2(1.688,2.54) 3(-0.603,2.54) 4(-2.893,2.54) 5(-5.182,2.54) 6(5.128,0) 7(2.837,0) 8(0.548,0) 9(-1.743,0) 10(-4.042,0) 11(3.978,-2.54) 12(1.688,-2.54) 13(-0.603,-2.54) 14(-2.893,-2.54) 15(-5.182,-2.54)
  round 4 hole 3: 16(12.473,-0.254) 17(-12.473,-0.254)
HDR-TH_4P-P2.54-V-F
  rect 1.7x1.7 hole 1.1: 1(-3.81,0)
  round 1.7 hole 1.1: 2(-1.27,0) 3(1.27,0) 4(3.81,0)
HDR-TH_6P-P2.54-V-F-R2-C3-S2.54
  rect 1.7x1.6 hole 1: 1(-2.54,-1.27)
  round 1.6 hole 1: 2(-2.54,1.27) 3(0,-1.27) 4(0,1.27) 5(2.54,-1.27) 6(2.54,1.27)
LED0603-RD
  rect 0.8x0.8 smd: 1(-0.749,0) 2(0.749,0)
LED-SEG-TH_FJ5461AH
  round 1.55 hole 0.9: 1(-6.35,-7.62) 2(-3.81,-7.62) 3(-1.27,-7.62) 4(1.27,-7.62) 5(3.81,-7.62) 6(6.35,-7.62) 7(6.35,7.62) 8(3.81,7.62) 9(1.27,7.62) 10(-1.27,7.62) 11(-3.81,7.62) 12(-6.35,7.62)
OSC-SMD_4P-L3.2-W2.5-BL
  rect 1.4x1.2 smd: 1(-1.1,-0.875) 2(1.1,-0.875) 3(1.1,0.875) 4(-1.1,0.875)
Pad_e54
  round 6 hole 3: 1(0,0)
Pad_e56
  round 6 hole 3: 1(0,0)
Pad_e57
  round 6 hole 3: 1(0,0)
Pad_e58
  round 6 hole 3: 1(0,0)
R0603
  rect 0.806x0.864 smd: 1(-0.753,0) 2(0.753,0)
SOP-8_L4.9-W3.9-P1.27-LS6.0-BL
  oval 0.63x1.865 smd: 1(-1.905,-2.683) 2(-0.635,-2.683) 3(0.635,-2.683) 4(1.905,-2.683) 5(1.905,2.683) 6(0.635,2.683) 7(-0.635,2.683) 8(-1.905,2.683)
SOP-16_L9.9-W3.9-P1.27-LS6.0-BL
  oval 0.574x2.038 smd: 1(-4.445,-2.769) 2(-3.175,-2.769) 3(-1.905,-2.769) 4(-0.635,-2.769) 5(0.635,-2.769) 6(1.905,-2.769) 7(3.175,-2.769) 8(4.445,-2.769) 9(4.445,2.769) 10(3.175,2.769) 11(1.905,2.769) 12(0.635,2.769) 13(-0.635,2.769) 14(-1.905,2.769) 15(-3.175,2.769) 16(-4.445,2.769)
SOT-23-5_L3.0-W1.7-P0.95-LS2.8-BR
  rect 1.1x0.6 smd: 1(1.3,-0.95) 2(1.3,0) 3(1.3,0.95) 4(-1.3,0.95) 5(-1.3,-0.95)
SOT-23-6_L2.9-W1.6-P0.95-LS2.8-BL
  rect 0.532x1.072 smd: 1(-0.95,-1.149) 2(0,-1.149) 3(0.95,-1.149) 4(0.95,1.149) 5(0,1.149) 6(-0.95,1.149)
SW-TH_K6-6162D04
  round 1.7 hole 1: 1(2.54,-2.7) 2(2.54,2.7) 3(-2.54,-2.54) 4(-2.54,2.54) 5(0,-2.7) 6(0,2.7)
TQFP-32_L7.0-W7.0-P0.80-LS9.0-BL
  oval 0.45x1.65 smd: 1(-2.8,-4.369) 2(-2,-4.369) 3(-1.2,-4.369) 4(-0.4,-4.369) 5(0.4,-4.369) 6(1.2,-4.369) 7(2,-4.369) 8(2.8,-4.369) 17(2.8,4.369) 18(2,4.369) 19(1.2,4.369) 20(0.4,4.369) 21(-0.4,4.369) 22(-1.2,4.369) 23(-2,4.369) 24(-2.8,4.369)
  oval 1.65x0.45 smd: 9(4.381,-2.8) 10(4.381,-2) 11(4.381,-1.2) 12(4.381,-0.4) 13(4.381,0.4) 14(4.381,1.2) 15(4.381,2) 16(4.381,2.8) 25(-4.381,2.8) 26(-4.381,2) 27(-4.381,1.2) 28(-4.381,0.4) 29(-4.381,-0.4) 30(-4.381,-1.2) 31(-4.381,-2) 32(-4.381,-2.8)

## Nets
As in the schematic.

Pads without a net: D2 1 3; D3 1 3 4; NOREF 1; NOREF#2 1; NOREF#3 1; NOREF#4 1; SW1 2 4; SW2 2 4; SW3 2 4; U1 1 2 6 7 8; U3 1; U4 1; U5 1; U6 1 2 3 19 22 23 26 32

## Via types
v1: diameter 0.61, hole 0.305, Top Layer to Bottom Layer, 148 vias

## Routing (per net, layer and track width the routed paths; a pad name or vN(x,y) marks a point on that pad's centre or on a via; arc(x,y) is an arc through that point)
+5V: length 436.1
  Top Layer w0.635: 25.06,45.72 v1(25.06,42.67) v1(25.06,41.4) 27.18,39.28 27.18,35.1 v1(26.42,34.34) ; 25.06,45.72 v1(20.32,45.72) 6.6,45.72 ; 25.06,45.72 v1(35.37,45.72) v1(36.24,45.72) v1(37.08,45.72) ; 6.6,45.72 H1.1 ; 6.6,45.72 6.6,46.48 7.37,47.24 7.37,49.53 7.87,50.04 H2.2
  Inner1 w0.635: v1(75.63,16.76) 77.98,16.76 v1(80.26,19.05) 79.25,20.07 v1(74.93,20.07)
  Bottom Layer w0.254: v1(20.32,45.72) R11.2 18.29,46.22 D3.5 ; 82.04,2.09 81.79,1.84 U5.5 78.55,1.84 ; 19.05,18.54 17.27,18.54 15.75,17.02 R4.1 11.68,8.63 11.15,8.1 U4.5 9.39,6.28 C9.2 ; 78.55,1.84 77.72,1.02 76.45,1.02 R5.1 ; 78.55,1.84 78.55,9.33 77.47,10.41 ; 36.31,11.86 36.51,11.65 U3.5 36.51,9.72 38.85,7.37 R2.1 ; 36.31,11.86 C5.2 ; 36.31,11.86 36.32,11.87 36.32,18.8 ; 36.31,11.86 36.26,11.9 ; v1(26.42,34.34) 26.42,34.29 26.92,33.78 27.75,33.78 27.46,34.07 27.46,36.01 ; v1(75.63,16.76) C1.2 75.63,13.16 U1.3 ; D1.5 v1(74.93,20.07)
  Bottom Layer w0.381: C17.2 C16.2 25.06,46.56 U6.4 v1(25.06,42.67) v1(25.06,41.4)
  Bottom Layer w0.762: U2.10 74.61,48.89 C2.2 76.99,48.83 ; 76.99,48.83 C6.1 ; 76.99,48.83 76.99,50.52 76.07,51.44 56.51,51.44 53.09,48.01 R9.2 50.28,46.47 49.53,45.72 v1(37.08,45.72) v1(36.24,45.72) v1(35.37,45.72)
  Bottom Layer w1.27: 2.29,26.69 2.29,31.75 4.06,33.53 14.27,33.53 16.71,31.09 37.71,31.09 40.14,33.53 79.89,33.53 ; 2.29,26.69 CN1.13 ; 2.29,26.69 2.29,21.08 3.68,19.69 6.1,19.69 CN1.6 ; 83.57,33.53 79.89,33.53 ; 83.57,33.53 86.36,33.53 88.39,31.5 88.39,26.42 87.61,25.64 CN2.13 ; 83.57,33.53 83.57,33.52 CN2.6 ; 79.89,33.53 D2.6 D2.5 D2.4 79.89,41.02 ; 79.89,41.02 81.04,42.16 87.63,42.16 89.92,39.88 89.92,21.84 87.12,19.05 v1(80.26,19.05) 78.99,17.78 78.99,11.94 77.47,10.41 72.22,10.41 70.87,11.77 70.87,16.51 68.83,18.54 19.05,18.54 ; 79.89,41.02 76.99,43.91 C6.1
+12V-BUS: length 85.5
  Bottom Layer w1.27: CN1.4 CN1.5 10.8,32.16 13.7,32.16 16.14,29.72 38.27,29.72 40.71,32.16 77.57,32.16 78.99,30.73 78.99,24.38 80.03,23.35 CN2.4 CN2.5
GND: length 4.1
  Bottom Layer w0.254: D1.2 v1(74.93,17.78) ; D3.2 v1(18.29,48.77) ; C10.1 75.44,3.74 U5.3
  vias: v1(5.44,41) v1(5.44,10.52) v1(7.23,35.31) v1(10.52,51.16) v1(10.52,15.6) v1(10.52,10.52) v1(11.94,40.64) v1(15.6,51.16) v1(15.6,41) v1(15.6,35.92) v1(15.6,20.68) v1(17.53,35.31) v1(18.42,43.56) v1(20.6,34.42) v1(20.68,51.16) v1(20.68,20.68) v1(20.68,15.6) v1(20.68,10.52) v1(20.68,5.44) v1(20.83,44.45) v1(22.22,34.4) v1(23.37,38.99) v1(25.02,38.99) v1(25.76,20.68) v1(26.29,41.78) v1(26.29,17.02) v1(27.69,16) v1(27.81,42.55) v1(30.23,17.02) v1(30.84,35.92) v1(30.84,20.68) v1(30.84,10.52) v1(30.84,5.44) v1(31.75,38.1) v1(32.77,10.41) v1(34.04,13.97) v1(35.31,44.2) v1(35.56,40.26) v1(35.92,51.16) v1(35.92,20.68) v1(37.08,20.83) v1(41,51.16) v1(41,15.6) v1(41,5.44) v1(42.93,13.21) v1(45.34,39.75) v1(46.08,51.16) v1(46.08,30.84) v1(46.08,5.44) v1(47.24,46.74) v1(47.24,43.18) v1(50.04,43.69) v1(50.04,40.89) v1(51.16,30.84) v1(51.16,10.52) v1(51.16,5.44) v1(52.58,50.29) v1(53.59,43.69) v1(56.24,30.84) v1(56.24,10.52) v1(56.24,5.44) v1(57.66,43.69) v1(60.32,21.21) v1(60.46,49.38) v1(61.32,30.84) v1(61.32,10.52) v1(61.32,5.44) v1(61.72,45.98) v1(61.72,43.69) v1(65.79,13.21) v1(66.29,17.02) v1(66.4,15.6) v1(68.83,43.43) v1(69.85,20.32) v1(69.98,42.04) v1(73.66,28.19) v1(73.66,24.51) v1(75.29,44.96) v1(76.2,36.32) v1(76.56,30.84) v1(77.67,39.6) v1(81.64,15.6) v1(81.64,10.52) v1(81.64,5.44) v1(81.67,50.78) v1(81.67,45.7) v1(83.88,35.31) v1(86.72,10.52)
A: length 39.4
  Inner1 w0.635: v1(63.63,50.17) 63.63,48.39 65.06,46.95 65.06,40.42 v1(65.02,40.39)
  Bottom Layer w0.254: LED1.11 43.89,37.8 49.63,37.8 52.75,40.92 64.49,40.92 v1(65.02,40.39) ; v1(63.63,50.17) U2.8
ACCESS: length 77.1
  Inner1 w0.635: v1(77.47,29.21) 80.02,29.21 81.03,30.22
  Inner2 w0.635: v1(77.47,29.21) 77.09,29.21 76.45,28.58 76.45,24.13 75.16,22.83 10.63,22.83 9.91,22.11
B: length 34.8
  Inner1 w0.635: v1(70.61,50.17) 69.18,48.73 69.18,44.61 v1(70.61,43.18)
  Bottom Layer w0.254: v1(70.61,50.17) U2.9 ; v1(70.61,43.18) 70.61,41.66 67.74,38.79 61.8,38.79 61.09,39.5 53.34,39.5 51.82,37.97 LED1.7
BUSIO1: length 78.3
  Top Layer w0.381: v1(73.66,26.79) 73.66,26.79 83.56,26.79 CN2.8 ; v1(11.94,25.53) 11.93,25.54 7.37,25.54 CN1.8
  Inner2 w0.635: v1(73.66,26.79) 73.66,25.89 72.08,24.31 13.16,24.31 v1(11.94,25.53)
BUSIO2: length 86.5
  Top Layer w0.381: CN1.9 7.37,27.83 11.92,27.83 v1(11.94,27.81) ; CN2.9 83.56,24.5 v1(74.54,24.5)
  Inner2 w0.635: v1(11.94,27.81) 11.94,30.23 13.72,32 73.91,32 74.53,31.38 v1(74.53,24.5)
BUSIO3: length 87.2
  Top Layer w0.381: CN2.12 86.1,27.93 82.94,27.93 81.8,29.07 79.64,29.07 78.74,29.97 v1(73.66,29.97)
  Inner2 w0.635: v1(73.66,29.97) 72.64,28.96 72.64,25.92 71.77,25.05 14.2,25.05 v1(13.72,25.53)
  Bottom Layer w0.381: CN1.12 4.83,24.39 8.14,24.39 9.29,25.54 10.81,25.54 11.56,26.29 12.95,26.29 v1(13.72,25.53)
BUSIO4: length 94.4
  Inner2 w0.635: CN2.15 87.63,22.58 87.63,30.48 87.38,30.73 87.38,30.74 86.63,31.49 86.62,31.49 85.34,32.77 6.33,32.77 CN1.15
BUTTON1: length 48
  Inner1 w0.254: v1(35.56,9.91) 35.56,10.46 34.8,11.23 33.49,11.23 27.48,17.23 27.48,29.26 33.53,35.3 v1(33.53,36.37)
  Inner2 w0.254: v1(21.59,35.81) 22.35,35.05 32.21,35.05 v1(33.53,36.37)
  Bottom Layer w0.254: v1(35.56,9.91) 34.64,9.91 U3.4 ; v1(21.59,35.81) 22.47,35.81 22.66,36.01
BUTTON2: length 47.2
  Inner1 w0.254: v1(12.45,4.38) 26.77,18.71 26.77,27.9 26.07,28.6 22.96,28.6 19.05,32.51 v1(19.05,34.42)
  Bottom Layer w0.254: v1(19.05,34.42) 19.05,37.08 19.56,37.59 21.06,37.59 U6.25 ; U4.4 v1(12.45,4.38)
BUTTON3: length 90.8
  Inner1 w0.254: v1(35.43,35.69) 35.43,35.69 28.55,28.81 28.55,17.67 33.93,12.29 73.3,12.29 79.79,5.81 v1(79.79,2.79)
  Bottom Layer w0.254: U6.12 29.85,40.77 33.91,40.77 35.43,39.24 v1(35.43,35.69) ; U5.4 v1(79.79,2.79)
C: length 53.1
  Inner1 w0.635: v1(70.36,44.7) 71.63,43.43 71.63,39.62 67.51,35.51 67.51,23.14 62.43,18.06 49,18.06 LED1.4
  Bottom Layer w0.254: v1(70.36,44.7) 69.6,45.47 69.6,46.74 70.49,47.62 U2.11
CLK: length 47.7
  Inner1 w0.254: v1(26.67,43.18) 33.78,43.18 v1(35.05,41.91)
  Bottom Layer w0.254: C3.2 47.69,42.36 47.24,41.91 47.24,40.13 46.23,39.12 37.85,39.12 v1(35.05,41.91) ; C3.2 48.7,42.55 U2.2 ; C3.2 R1.1 ; v1(26.67,43.18) 26.66,43.19 U6.6
D: length 59.2
  Inner1 w0.635: v1(70.36,45.97) 72.39,43.94 72.39,38.1 68.99,34.7 68.99,22.53 63.04,16.58 45.39,16.58 LED1.2
  Bottom Layer w0.254: U2.12 70.74,46.36 v1(70.36,45.97)
DAT: length 44
  Inner1 w0.254: v1(29.84,43.94) 34.16,43.94 v1(35.31,42.8)
  Bottom Layer w0.254: v1(35.31,42.8) 38.63,39.47 44.04,39.47 44.96,40.39 44.96,41.34 C7.2 R3.1 46.73,44.96 63.25,44.96 64.39,43.81 U2.3 ; v1(29.84,43.94) 29.84,43.18 U6.9
DIG1: length 30.1
  Bottom Layer w0.254: LED1.12 41.71,38.15 49.48,38.15 52.6,41.28 U2.1
DIG2: length 29.4
  Inner1 w0.635: v1(63.75,39.75) v1(63.75,46.36)
  Bottom Layer w0.254: LED1.9 46.74,36.58 47.24,37.08 49.92,37.08 53.04,40.21 63.3,40.21 v1(63.75,39.75) ; v1(63.75,46.36) U2.5
DIG3: length 28
  Inner1 w0.635: v1(62.74,39.37) v1(62.74,47.62)
  Bottom Layer w0.254: v1(62.74,39.37) 62.26,39.85 53.19,39.85 49.28,35.93 LED1.8 ; v1(62.74,47.62) U2.6
DIG4: length 43
  Inner1 w0.635: v1(64.9,48.89) 65.8,47.99 65.8,40.06 64.9,39.16 64.9,22.61 62.61,20.32 LED1.6
  Bottom Layer w0.254: v1(64.9,48.89) U2.7
DP: length 47.7
  Inner1 w0.635: LED1.3 47.19,17.32 62.74,17.32 68.25,22.84 68.25,35.1 v1(70.88,37.73)
  Bottom Layer w0.254: v1(70.88,37.73) 72.37,39.22 U2.16
E: length 61.8
  Inner1 w0.635: v1(74.29,45.08) 73.13,43.92 73.13,37.79 69.72,34.39 69.72,22.23 63.35,15.85 43.59,15.85 LED1.1
  Bottom Layer w0.254: v1(74.29,45.08) U2.13
F: length 33.6
  Bottom Layer w0.254: U2.14 70.23,43.81 69.34,42.93 69.34,40.89 68.07,39.62 64.77,39.62 63.83,40.56 52.9,40.56 49.77,37.44 46.08,37.44 LED1.10
G: length 41.9
  Inner1 w0.635: LED1.5 50.8,18.8 62.12,18.8 66.78,23.45 66.78,36.07 v1(70.22,39.51)
  Bottom Layer w0.254: v1(70.22,39.51) 70.97,40.26 70.97,41.89 71.63,42.55 U2.15
INTERRUPT: length 168.4
  Inner1 w0.254: v1(26.16,27.69) 25.6,28.25 22.81,28.25 18.29,32.77 v1(18.29,39.88)
  Inner1 w0.635: CN2.7 82.3,30.35 82.3,30.99 81.66,31.62 72.77,31.62 71.5,30.35 v1(71.5,21.59)
  Inner2 w0.635: v1(71.5,21.59) 70.99,22.1 11.81,22.1 10.41,20.7 9.27,20.7 8.64,21.34 8.64,21.98 CN1.7
  Bottom Layer w0.254: v1(18.29,39.88) 18.99,39.18 U6.27 ; v1(71.5,21.59) 71.88,21.22 D1.4 D1.3 72.52,18.92 69.34,22.1 27.18,22.1 26.16,23.11 v1(26.16,27.69)
LED1: length 45.6
  Inner1 w0.254: v1(32.51,40) 34.16,38.35 34.16,35.43 27.84,29.11 27.84,17.38 33.63,11.58 39.97,11.58 v1(40.64,10.91)
  Bottom Layer w0.254: v1(32.51,40) 32.48,39.98 U6.13 ; R8.2 v1(40.64,10.91)
LED2: length 33.5
  Inner1 w0.254: v1(23.63,13.21) 27.13,16.7 27.13,29.41 32.84,35.13 32.84,38.28 v1(32,39.12)
  Bottom Layer w0.254: v1(32,39.12) 31.94,39.18 U6.14 ; R6.2 v1(23.63,13.21)
LED3: length 86.1
  Inner1 w0.254: v1(76.71,5.59) 70.36,11.94 33.78,11.94 28.19,17.53 28.19,28.96 34.82,35.58 34.82,40.23 v1(32.77,42.29)
  Bottom Layer w0.254: v1(32.77,42.29) 32.68,42.38 U6.10 ; R7.2 v1(76.71,5.59)
MISO: length 29.4
  Inner2 w0.254: v1(28.19,37.59) 18.55,37.59 16.87,39.27 11.45,39.27 v1(11.43,39.24)
  Bottom Layer w0.254: U6.16 29.82,37.59 v1(28.19,37.59) ; v1(11.43,39.24) 7.87,42.8 7.87,46.23 H2.1
MOSI: length 29.4
  Inner2 w0.254: v1(28.19,38.35) 27.58,38.35 27.17,37.95 18.69,37.95 17.02,39.62 15.49,39.62 12.95,42.16 11,42.16 10.41,42.75 10.41,48.77 H2.4
  Bottom Layer w0.254: v1(28.19,38.35) 28.22,38.38 U6.15
NTC-IN: length 29.5
  Bottom Layer w0.254: R10.1 43.8,46.33 34.9,46.33 34.29,45.72 34.29,42.67 33.19,41.58 U6.11 28.37,41.58 26.77,39.98 U6.28
ONEWIRE: length 90.9
  Inner1 w0.635: CN2.2 v1(75.44,27.93)
  Inner2 w0.635: v1(75.44,27.93) 75.44,24.16 74.85,23.57 10.73,23.57 CN1.2
  Bottom Layer w0.254: v1(75.44,27.93) 75.44,23.88 75.88,23.43 D1.6 D1.1 75.88,18.73 76.84,17.78 U1.4
RESET: length 17.3
  Inner1 w0.254: H2.5 17.02,47.5 19.3,45.21 v1(19.3,40.78)
  Bottom Layer w0.254: R11.1 17.34,45.78 D3.6 14.34,47.62 H2.5 ; U6.29 v1(19.3,40.78)
RX: length 7.8
  Bottom Layer w0.254: U6.30 18.37,41.58 16.01,43.94 H1.4
SCK: length 33.3
  Inner2 w0.254: v1(29.21,36.32) 26.92,36.32 26.01,37.24 18.39,37.24 17.27,38.35 10.92,38.35 10.42,38.86 v1(10.42,41.39)
  Bottom Layer w0.254: H2.3 11.68,46.23 10.41,44.96 10.41,42.16 10.42,42.16 v1(10.42,41.39) LED2.2 ; 28.26,36.01 28.26,36.32 v1(29.21,36.32)
SHIELD: length 138
  Inner2 w0.635: 83.77,38.66 83.57,38.86 ; 83.77,38.66 78.61,33.5 12.17,33.5 CN1.17 3.3,34.75 3.3,17.42 CN1.16 ; 83.77,38.66 88.37,34.06 88.37,18.31 CN2.17
SW1: length 11.1
  Bottom Layer w0.254: R2.2 37.35,4.31 37.85,3.81 41.51,3.81 SW3.1 ; U3.2 35.56,5.36 35.58,5.33 ; 35.24,5.33 35.58,5.33 ; 35.58,5.33 37.09,5.33
SW2: length 12.1
  Bottom Layer w0.254: SW1.1 19.41,7.12 R4.2 C8.2 15.69,5.33 U4.2
SW3: length 11.7
  Bottom Layer w0.254: U5.2 74.68,2.79 R5.2 73.66,2.29 73.66,3.49 C10.2 73.47,4.32 70.87,4.32 70.36,4.83 68.42,4.83 SW2.1
TX: length 11.2
  Bottom Layer w0.254: U6.31 18.08,42.38 15.24,45.21 12.7,45.21 11.68,44.2 H1.3
XTAL+: length 7.9
  Bottom Layer w0.254: U6.7 27.49,44.78 27.49,46.22 27.75,46.48 27.75,48.53 X1.1 25.74,50.54 C13.2
XTAL-: length 6.7
  Bottom Layer w0.254: U6.8 28.26,47.04 X1.3 28.99,47.74 30.79,47.74 31.04,47.99 C12.2
$2N1913: length 4.2
  Bottom Layer w0.254: R6.1 25.15,14.47 SW1.5
$2N1920: length 8.8
  Bottom Layer w0.254: R7.1 73.41,6.1 66.96,6.1 SW2.5
$2N1927: length 5.2
  Bottom Layer w0.254: R8.1 39.12,8.13 39.62,7.62 SW3.5
$4N459: length 4.7
  Bottom Layer w0.762: CN3.2 48.78,50.54 R9.1 R10.2
$4N1957: length 1.8
  Bottom Layer w0.254: R12.2 13.47,39.88 LED2.1
$4N3056: length 2.5
  Bottom Layer w0.254: C14.2 25.83,34.53 25.83,35.98 25.86,36.01

## Copper pours and planes (outline as drawn; the poured copper is in the pictures)
GND on Top Layer: -2.03,54.86 93.22,54.86 93.22,-3.3 -2.03,-3.3
GND on Bottom Layer: -1.78,54.86 92.2,54.86 92.2,-2.29 -1.78,-2.29
GND on Inner1: -2.79,55.88 92.96,55.88 92.96,-2.54 -2.79,-2.54
GND on Inner2: -3.56,57.15 95.25,57.15 95.25,-3.81 -3.56,-3.81

## Text on the board
Bottom Silkscreen Layer: ACS Temperature Sensor | Licensed CERN OHL-S 2.0 | Version 3.0.0 | March 2026 | Jim Heaney, RIT SHED Makerspace
Top Silkscreen Layer: 5 O G | 5 G T R | I C R | Decrement | 10K NTC Thermistor | Action | Increment
